# EAGLE design PCB (EAGLE 9.6.2)
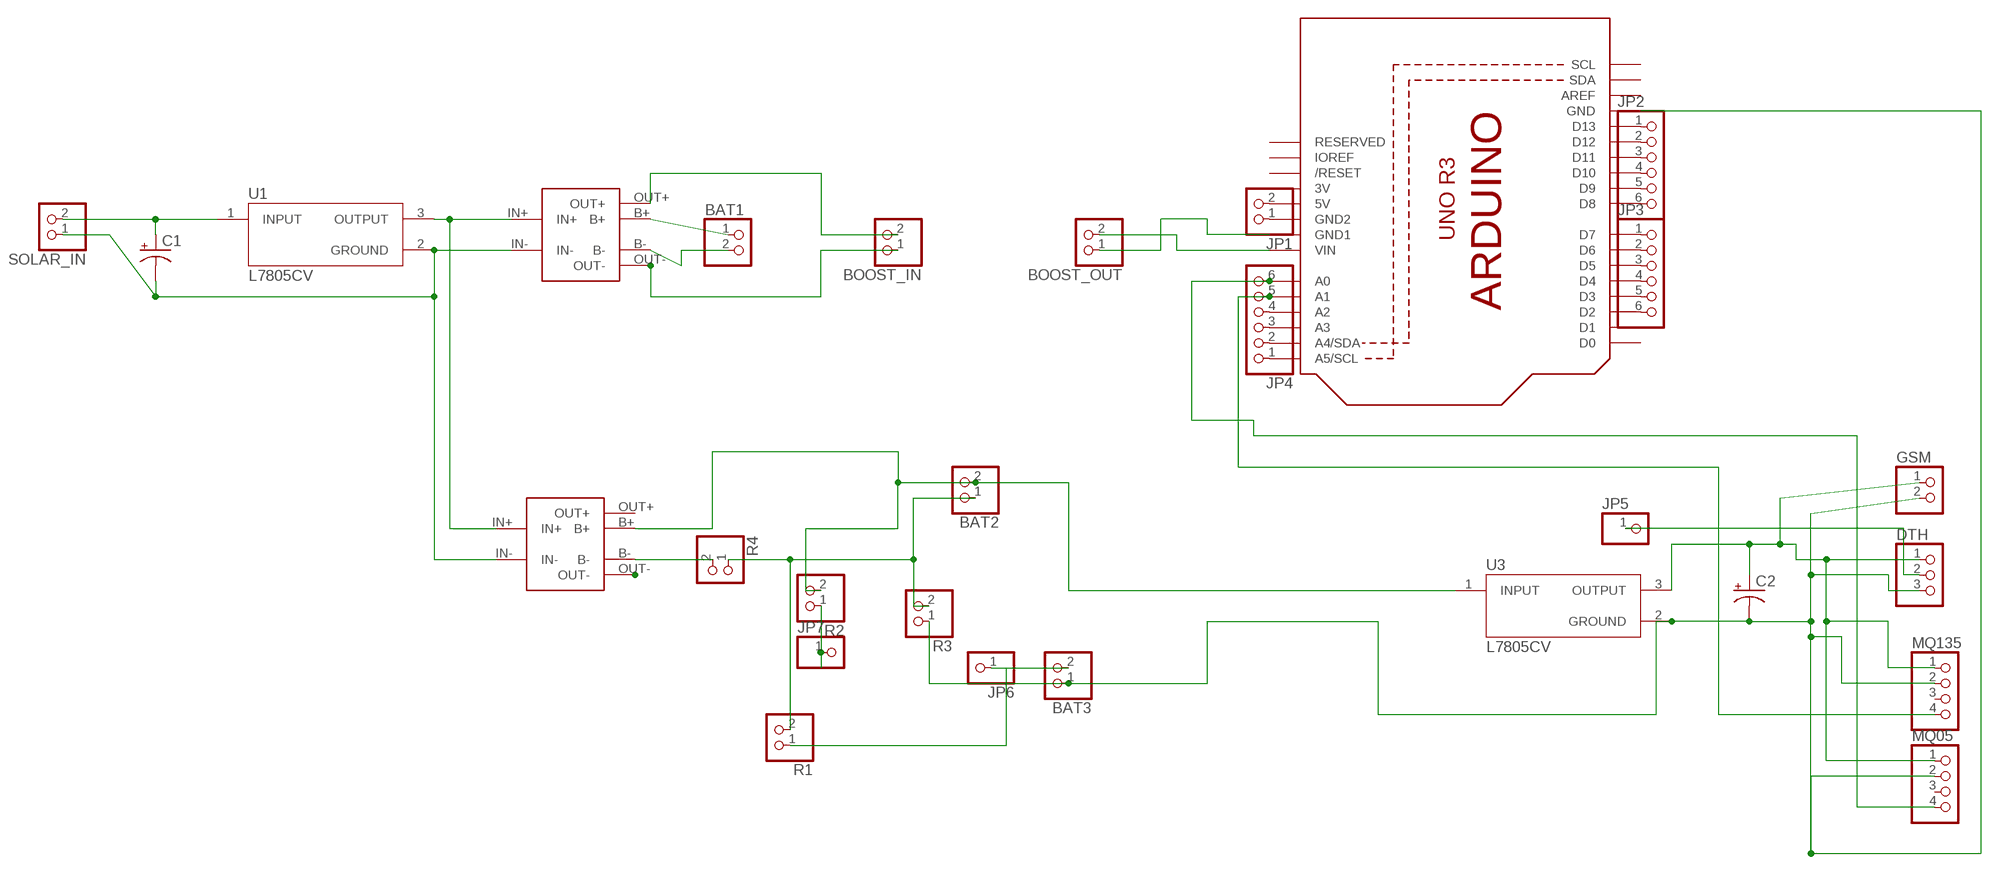
[diagram p0: schematic, sheet 1]

## Parts
BAT1  PINHD-1X2  [1X02]
BAT2  PINHD-1X2  [1X02]
BAT3  PINHD-1X2  [1X02]
BOOST_IN  PINHD-1X2  [1X02]
BOOST_OUT  PINHD-1X2  [1X02]
C1  C-POL-US_RADIAL-11MM-DIA  [CAPPRD508W65D1000H1100B]
C2  C-POL-US_RADIAL-11MM-DIA  [CAPPRD508W65D1000H1100B]
DTH  PINHD-1X3  [1X03]
GSM  PINHD-1X2  [1X02]
JP1  PINHD-1X2  [1X02]
JP2  PINHD-1X6  [1X06]
JP3  PINHD-1X6  [1X06]
JP4  PINHD-1X6  [1X06]
JP5  PINHD-1X1  [1X01]
JP6  PINHD-1X1  [1X01]
JP7  PINHD-1X1  [1X01]
MQ05  PINHD-1X4  [1X04]
MQ135  PINHD-1X4  [1X04]
R1  PINHD-1X2  [1X02]
R2  PINHD-1X2  [1X02]
R3  PINHD-1X2  [1X02]
R4  PINHD-1X2  [1X02]
SOLAR_IN  PINHD-1X2  [1X02]
U1  L7805CV  [TO255P1040X460X1968-3]
U2  ARDUINOR3-DIMENSION  [ARDUINOR3]
U3  L7805CV  [TO255P1040X460X1968-3]
U$3  TP4056-PTH  [TP4056-PTH]
U$5  TP4056-PTH  [TP4056-PTH]

## Nets
N$1: U1.3(OUTPUT) U$3.IN+ U$5.IN+
N$2: C1.2(-) SOLAR_IN.1 U1.2(GROUND) U$3.IN- U$5.IN-
N$3: C1.1(+) SOLAR_IN.2 U1.1(INPUT)
N$4: BAT1.1 U$3.B+
N$5: BAT1.2 U$3.B-
N$6: BOOST_IN.2 U$3.OUT+
N$7: BOOST_IN.1 U$3.OUT-
N$8: BOOST_OUT.2 U2.VIN
N$9: BOOST_OUT.1 U2.GND1
N$10: JP4.4 U2.A2
N$11: R4.2 U$5.B-
N$12: BAT2.1 R1.2 R3.2 R4.1
N$13: BAT3.2 JP6.1
N$14: DTH.2 JP5.1
N$15: JP4.5 MQ135.4 U2.A1
N$16: BAT3.1 C2.2(-) DTH.3 GSM.2 MQ05.2 MQ135.2 R3.1 U2.GND U3.2(GROUND)
N$17: C2.1(+) DTH.1 GSM.1 MQ05.1 MQ135.1 U3.3(OUTPUT)
N$18: JP4.6 MQ05.4 U2.A0
N$19: JP7.1 R2.1
N$20: U$5.OUT-
N$21: JP1.2 U2.5V
N$22: JP1.1 U2.GND2
N$23: BAT2.2 R2.2 U3.1(INPUT) U$5.B+
N$24: JP2.1 U2.D13
N$25: JP2.2 U2.D12
N$26: JP2.3 U2.D11
N$27: JP2.4 U2.D10
N$28: JP2.5 U2.D9
N$29: JP2.6 U2.D8
N$30: JP3.1 U2.D7
N$31: JP3.2 U2.D6
N$32: JP3.3 U2.D5
N$33: JP3.4 U2.D4
N$34: JP3.5 U2.D3
N$35: JP3.6 U2.D2
N$36: JP4.1 U2.A5(A5/SCL)
N$37: JP4.2 U2.A4(A4/SDA)
N$38: JP4.3 U2.A3
N$39: R1.1
Unconnected: MQ05.3 MQ135.3 U2.AREF U2.D0 U2.D1 U2.IOREF U2.RESERVED U2.RESET(/RESET) U2.SCL U2.SDA U$5.OUT+

## Power pins joined to a net without a drawn wire
3V: U2.3V

## Library data of the parts
BAT1-BAT3 BOOST_IN BOOST_OUT GSM R1-R4 SOLAR_IN = Connector:PINHD-1X2: PIN HEADER; CATEGORY: CONNECTOR; SUB-CATEGORY: PIN-HEADER
C1 C2 = Capacitor:C-POL-US: Capacitor Polarised - ANSI; CATEGORY: Capacitor
DTH = pinhead:PINHD-1X3: PIN HEADER
JP1 = pinhead:PINHD-1X2: PIN HEADER
JP2-JP4 = pinhead:PINHD-1X6: PIN HEADER
JP5-JP7 = pinhead:PINHD-1X1: PIN HEADER
MQ05 MQ135 = pinhead:PINHD-1X4: PIN HEADER
U1 U3 = L7805CV:L7805CV: Standard Regulator Pos 5V 1.5A 3-Pin(3+Tab) TO-220 Standard Regulator Pos 5V 1.5A 3-Pin(3+Tab) TO-220 Check availability <https://pricing.snapeda.com/parts/L7805CV/STMicroelectronics/view-part?ref=eda>; AVAILABILITY: In Stock; DESCRIPTION: Linear Voltage Regulator IC Positive Fixed 1 Output 1.5A TO-220; MF: STMicroelectronics; MP: L7805CV; PACKAGE: TO-220-3 ON Semiconductor; PRICE: None; PURCHASE-URL: https://pricing.snapeda.com/search/part/L7805CV/?ref=eda
U2 = adafruit:ARDUINOR3: This is a new object for the new Arduino R3 - with extra pins that you may want to use (such as IOref, and duplicated A4/A5
U$3 U$5 = 32teeth - TP4056 Module:TP4056-PTH

## Board
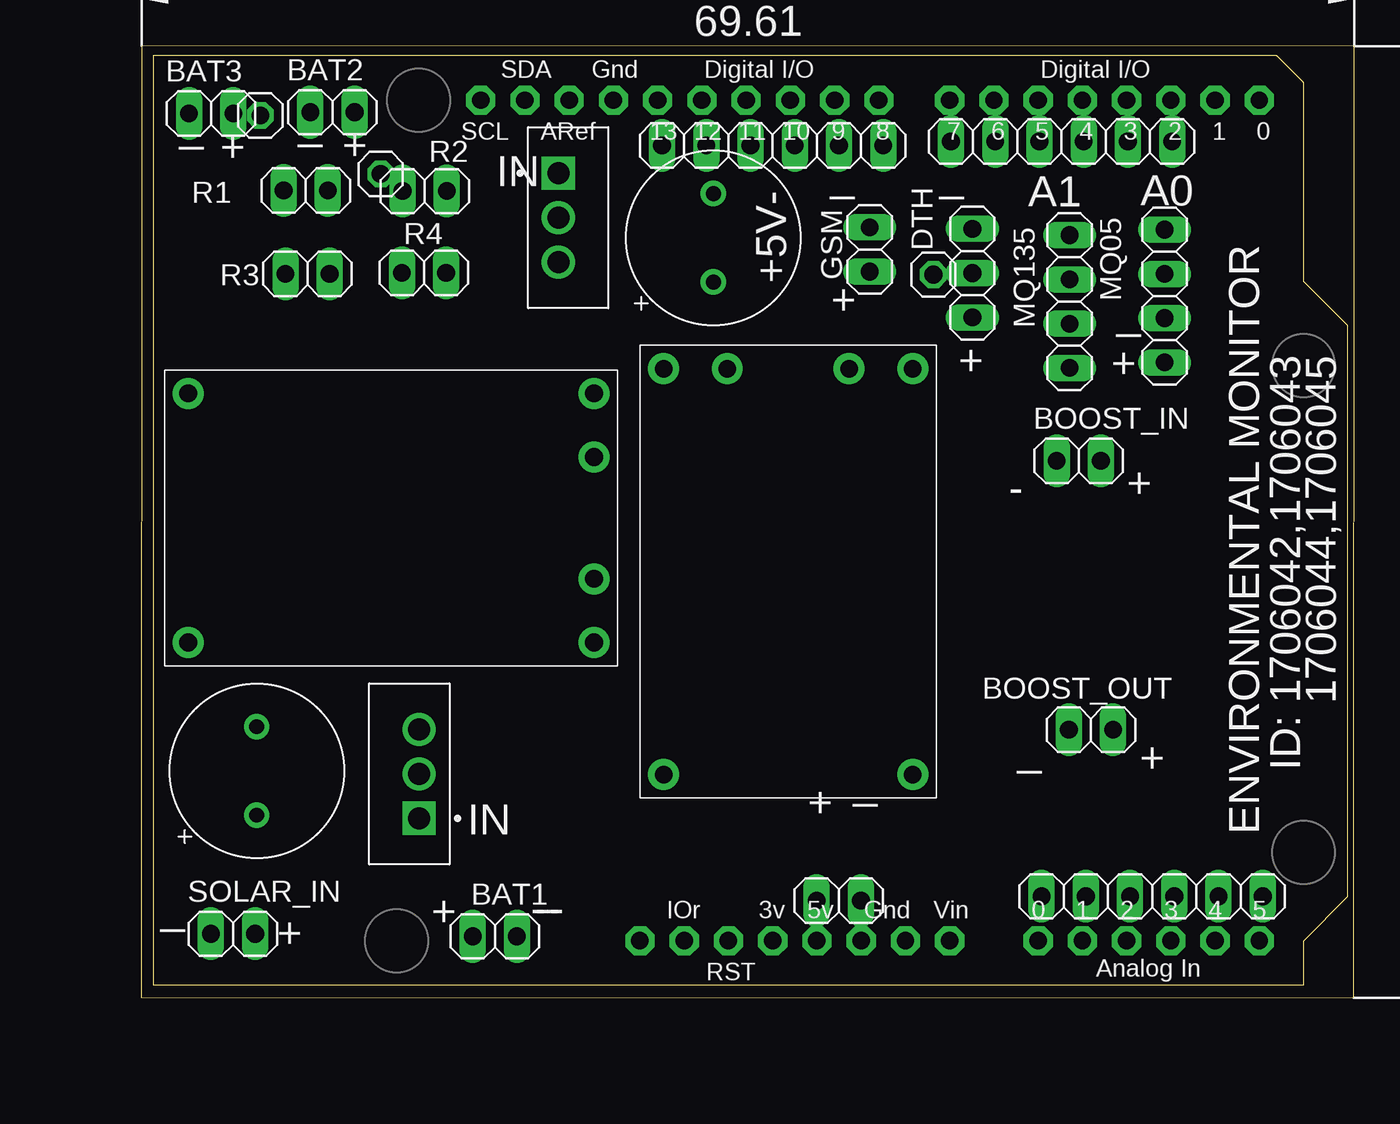
[diagram p1: board, top side]
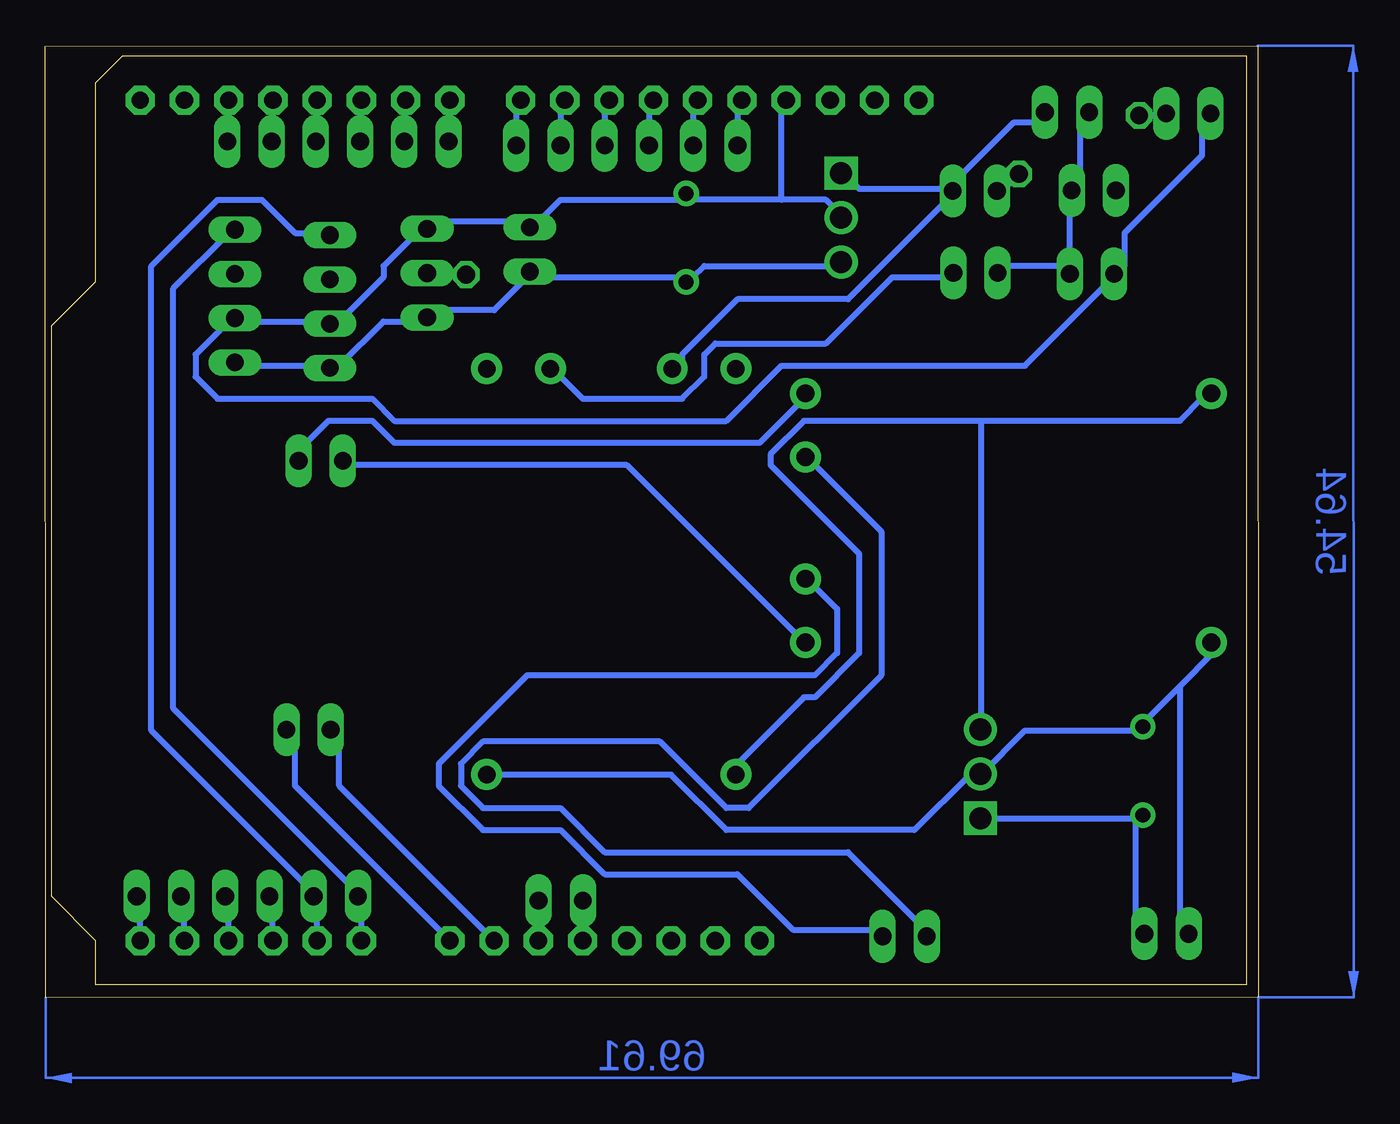
[diagram p2: board, bottom side, seen from below]

Size 69.65 x 54.65 mm. Coordinates in mm from the lower left corner, seen from the top.
Outline: 0,0.01 69.61,0 69.65,54.64 0.03,54.65 0,0.01
Copper layers (1*16): Top 0.035mm / dielectric 1.5mm / Bottom 0.035mm
Design rules "default *": minimum track width 14mil, minimum drill 0.35mm, track to track 15mil, track to pad 15mil, pad to pad 6mil, via to via 6mil, smd to smd 6mil, copper to edge 40mil, drill to drill 6mil, minimum pad ring 10mil, minimum via ring 8mil, stop-mask expansion 4mil, vias tented up to drill 0mil, thermal gap 10mil

### Footprints (pad centres in the part's own frame; a part is rotated, then mirrored left to right if it is on the bottom)
1X02 = drill 1.016 long: 1 -1.27,0; 2 1.27,0
CAPPRD508W65D1000H1100B = drill 0.85 pad 1.45: 1 -2.54,0; 2 2.54,0
1X03 = drill 1.016 long: 1 -2.54,0; 2 0,0; 3 2.54,0
1X06 = drill 1.016 long: 1 -6.35,0; 2 -3.81,0; 3 -1.27,0; 4 1.27,0; 5 3.81,0; 6 6.35,0
1X01 = drill 1.016 octagon: 1 0,0
1X04 = drill 1.016 long: 1 -3.81,0; 2 -1.27,0; 3 1.27,0; 4 3.81,0
TO255P1040X460X1968-3 = drill 1.27 pad 1.91 square: 1 0,0 | drill 1.27 pad 1.91: 2 2.55,0; 3 5.1,0
ARDUINOR3 = drill 1 pad 1.676 octagon: 3V 35.56,2.54; 5V 38.1,2.54; A0 50.8,2.54; A1 53.34,2.54; A2 55.88,2.54; A3 58.42,2.54; A4 60.96,2.54; A5 63.5,2.54; AREF 23.876,50.8; D0 63.5,50.8; D1 60.96,50.8; D2 58.42,50.8; D3 55.88,50.8; D4 53.34,50.8; D5 50.8,50.8; D6 48.26,50.8; D7 45.72,50.8; D8 41.656,50.8; D9 39.116,50.8; D10 36.576,50.8; D11 34.036,50.8; D12 31.496,50.8; D13 28.956,50.8; GND 26.416,50.8; GND1 43.18,2.54; GND2 40.64,2.54; IOREF 30.48,2.54; RESERVED 27.94,2.54; RESET 33.02,2.54; SCL 18.796,50.8; SDA 21.336,50.8; VIN 45.72,2.54
TP4056-PTH = drill 1.016 pad 1.778: B+ 12,1.35; B- 5,1.35; IN+ 15.65,24.65; IN- 1.35,24.65; OUT+ 15.65,1.35; OUT- 1.35,1.35

### Placement (x,y rotation side)
BAT1  20.3,3.52 0 top
BAT2  10.98,50.84 0 top
BAT3  4.01,50.77 0 top
BOOST_IN  53.83,30.83 0 top
BOOST_OUT  54.52,15.38 0 top
C1  6.63,13.02 90 top
C2  32.85,43.63 90 top
DTH  47.72,41.6 90 top
GSM  41.83,42.96 90 top
JP1  40.05,5.57 180 top
JP2  36.25,48.93 0 top
JP3  52.84,49.16 0 top
JP4  58.04,5.82 180 top
JP5  45.48,41.52 0 top
JP6  6.84,50.66 0 top
JP7  13.75,47.29 0 top
MQ05  58.75,40.29 90 top
MQ135  53.3,39.97 90 top
R1  9.45,46.35 0 top
R2  16.27,46.32 0 top
R3  9.55,41.57 0 top
R4  16.24,41.62 0 top
SOLAR_IN  5.27,3.67 0 top
U1  15.95,10.3 90 top
U2  0.69,0.73 0 top
U3  23.95,47.34 270 top
U$3  27.35,19.05 90 top
U$5  45.64,37.46 180 top

### Tracks (layer width: path | path; a pad name or v marks a point on that pad's centre or on a via)
N$1
  Bottom 0.356: 15.93,33.12 4.5,33.12 3.23,34.39 U$3.IN+ | 15.93,33.12 26.09,33.12 28,31.21 28,30.58 22.92,25.5 22.92,19.78 25.46,17.24 26.09,17.24 29.9,13.43 U$5.IN+ | 15.93,33.12 15.93,15.97 U1.3
N$2
  Bottom 0.356: 4.5,17.88 2.6,19.78 U$3.IN- | 4.5,17.88 6.41,15.97 C1.2 7.04,15.34 13.39,15.34 15.93,12.8 U1.2 16.57,12.8 19.74,9.62 30.54,9.62 33.71,12.8 43.87,12.8 U$5.IN- | 4.5,17.88 4.5,3.91 SOLAR_IN.1
N$3
  Bottom 0.356: 7.04,10.26 7.04,3.91 SOLAR_IN.2 | 7.04,10.26 15.93,10.26 U1.1 | 7.04,10.26 C1.1
N$4
  Bottom 0.356: BAT1.1 19.11,3.91 23.55,8.35 37.52,8.35 40.06,10.89 44.51,10.89 45.78,12.16 45.78,13.43 44.51,14.7 34.35,14.7 30.54,10.89 29.27,10.89 21.65,18.51 21.65,26.77 25.46,30.58 U$3.B+
N$5
  Bottom 0.356: BAT1.2 21.65,3.91 26.73,3.91 29.9,7.08 37.52,7.08 40.06,9.62 44.51,9.62 47.05,12.16 47.05,13.43 41.97,18.51 25.46,18.51 24.19,19.78 24.19,22.32 25.46,23.59 U$3.B-
N$6
  Bottom 0.356: BOOST_IN.2 54.67,31.21 54.67,31.85 53.4,33.12 50.86,33.12 49.59,31.85 28.63,31.85 26.09,34.39 U$3.OUT+
N$7
  Bottom 0.356: BOOST_IN.1 52.13,30.58 36.25,30.58 26.09,20.42 U$3.OUT-
N$8
  Bottom 0.356: U2.VIN 55.3,12.16 55.3,15.34 BOOST_OUT.2
N$9
  Bottom 0.356: U2.GND1 52.76,12.16 52.76,15.34 BOOST_OUT.1
N$10
  Bottom 0.356: U2.A2 56.57,5.81 JP4.4
N$11
  Bottom 0.356: R4.2 17.84,41.37 21.01,41.37 24.82,37.56 31.17,37.56 31.81,36.93 31.81,35.66 33.08,34.39 38.79,34.39 40.06,35.66 U$5.B-
N$12
  Bottom 0.356: BAT2.1 10.22,50.26 10.22,46.45 R1.2 10.85,45.82 10.85,42.01 | 10.85,42.01 14.66,42.01 R4.1 | 10.85,42.01 R3.2
N$13
  Bottom 0.356: JP6.1 5.4,50.66 BAT3.2
N$14
  Bottom 0.356: JP5.1 45.56,41.6 DTH.2
N$15
  Bottom 0.356: U2.A1 54.03,5.81 JP4.5 54.67,6.45 63.56,15.34 63.56,42.01 59.75,45.82 57.21,45.82 55.3,43.91 53.4,43.91 MQ135.4
N$16
  Bottom 0.356: 27.36,45.82 24.82,45.82 24.19,45.18 U3.2 | 27.36,45.82 32.44,45.82 C2.2 33.08,45.82 40.06,45.82 41.33,44.55 GSM.2 41.97,44.55 47.68,44.55 DTH.3 48.32,43.91 50.22,42.01 50.22,41.37 52.76,38.83 MQ135.2 53.4,38.83 58.48,38.83 MQ05.2 59.11,38.83 61.02,36.93 61.02,35.66 59.75,34.39 50.86,34.39 49.59,33.12 30.54,33.12 27.36,36.29 13.39,36.29 8.31,41.37 R3.1 7.68,42.01 7.68,43.91 3.23,48.36 3.23,50.26 BAT3.1 | 27.36,45.82 27.36,51.53 U2.GND
N$17
  Bottom 0.356: MQ05.1 58.48,36.29 53.4,36.29 MQ135.1 52.76,36.29 50.22,38.83 48.32,38.83 DTH.1 47.68,39.47 43.87,39.47 41.97,41.37 GSM.1 41.33,41.37 33.08,41.37 C2.1 32.44,41.37 31.81,42.01 24.19,42.01 U3.3
N$18
  Bottom 0.356: U2.A0 51.49,5.81 JP4.6 52.13,6.45 62.29,16.61 62.29,40.74 59.11,43.91 MQ05.4
N$19
  Bottom 0.356: R2.1 14.73,46.31 JP7.1
N$21
  Bottom 0.356: U2.5V 38.79,5.18 JP1.2
N$22
  Bottom 0.356: U2.GND2 41.33,5.18 JP1.1
N$23
  Bottom 0.356: 17.84,46.45 22.92,46.45 23.55,47.09 U3.1 | 17.84,46.45 14.03,50.26 12.76,50.26 BAT2.2 | 17.84,46.45 R2.2 17.84,45.82 23.55,40.1 29.9,40.1 33.08,36.93 33.08,36.29 U$5.B+
N$24
  Bottom 0.356: JP2.1 29.9,48.99 29.9,51.53 U2.D13
N$25
  Bottom 0.356: JP2.2 32.44,48.99 32.44,51.53 U2.D12
N$26
  Bottom 0.356: JP2.3 34.98,48.99 34.98,51.53 U2.D11
N$27
  Bottom 0.356: JP2.4 37.52,48.99 37.52,51.53 U2.D10
N$28
  Bottom 0.356: JP2.5 40.06,48.99 40.06,51.53 U2.D9
N$29
  Bottom 0.356: JP2.6 42.6,48.99 42.6,51.53 U2.D8
N$30
  Bottom 0.356: U2.D7 46.41,49.63 JP3.1
N$31
  Bottom 0.356: U2.D6 48.95,49.63 JP3.2
N$32
  Bottom 0.356: U2.D5 51.49,49.63 JP3.3
N$33
  Bottom 0.356: U2.D4 54.03,49.63 JP3.4
N$34
  Bottom 0.356: U2.D3 56.57,49.63 JP3.5
N$35
  Bottom 0.356: U2.D2 59.11,49.63 JP3.6
N$36
  Bottom 0.356: U2.A5 64.19,5.81 JP4.1
N$37
  Bottom 0.356: U2.A4 61.65,5.81 JP4.2
N$38
  Bottom 0.356: U2.A3 59.11,5.81 JP4.3
(copper drawn outside any net)
  shapes: Bottom area x2

### Text on the board
tNames: _ | _ | + | + | IN | _ | _ | A1 | A0 | +5V- | + | _ | + | + | - | + | 1706044,1706045 | _ | ID: 1706042,1706043 | + | _ | + | IN | ENVIRONMENTAL MONITOR | _ | + | -- | -- | +